# EAGLE design hatino (EAGLE 7.5.0)
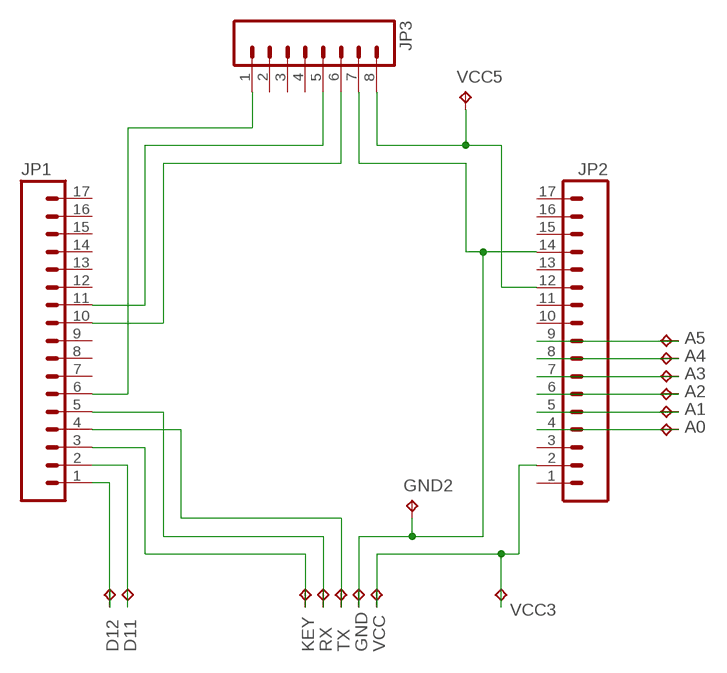
[diagram p0: schematic, sheet 1]

## Parts
A0  TPPAD1-13Y  [P1-13Y]
A1  TPPAD1-13Y  [P1-13Y]
A2  TPPAD1-13Y  [P1-13Y]
A3  TPPAD1-13Y  [P1-13Y]
A4  TPPAD1-13Y  [P1-13Y]
A5  TPPAD1-13Y  [P1-13Y]
D11  TPPAD1-13Y  [P1-13Y]
D12  TPPAD1-13Y  [P1-13Y]
GND  TPPAD1-13Y  [P1-13Y]
GND2  TPPAD1-13Y  [P1-13Y]
JP1  M17  [1X17]
JP2  M17  [1X17]
JP3  M08  [1X08_ROUND]
KEY  TPPAD1-13Y  [P1-13Y]
RX  TPPAD1-13Y  [P1-13Y]
TX  TPPAD1-13Y  [P1-13Y]
VCC  TPPAD1-13Y  [P1-13Y]
VCC3  TPPAD1-13Y  [P1-13Y]
VCC5  TPPAD1-13Y  [P1-13Y]

## Nets
N$1: D12.TP JP1.1
N$2: JP2.2 VCC3.TP VCC.TP
N$3: D11.TP JP1.2
N$4: A0.TP JP2.4
N$5: A1.TP JP2.5
N$6: A2.TP JP2.6
N$7: A3.TP JP2.7
N$8: A4.TP JP2.8
N$9: A5.TP JP2.9
N$12: JP2.12 JP3.8 VCC5.TP
N$14: GND2.TP GND.TP JP2.14 JP3.7
N$22: JP1.5 RX.TP
N$24: JP1.6 JP3.1
N$26: JP1.4 TX.TP
N$27: JP1.10 JP3.6
N$28: JP1.11 JP3.5
N$35: JP1.3 KEY.TP
Unconnected: JP1.7 JP1.8 JP1.9 JP1.12 JP1.13 JP1.14 JP1.15 JP1.16 JP1.17 JP2.1 JP2.3 JP2.10 JP2.11 JP2.13 JP2.15 JP2.16 JP2.17 JP3.2 JP3.3 JP3.4

## Library data of the parts
A0 A1-A5 D11 D12 GND GND2 KEY RX TX VCC VCC3 VCC5 = testpad:TP: Test pad
JP1 JP2 = SparkFun-Connectors:M17: 1x17 .1" header
JP3 = SparkFun-Connectors:M08: Header 8 Standard 8-pin 0.1" header. Use with straight break away headers (SKU : PRT-00116), right angle break away headers (PRT-00553), swiss pins (PRT-00743), machine pins (PRT-00117), and female headers (PRT-00115).

## Board
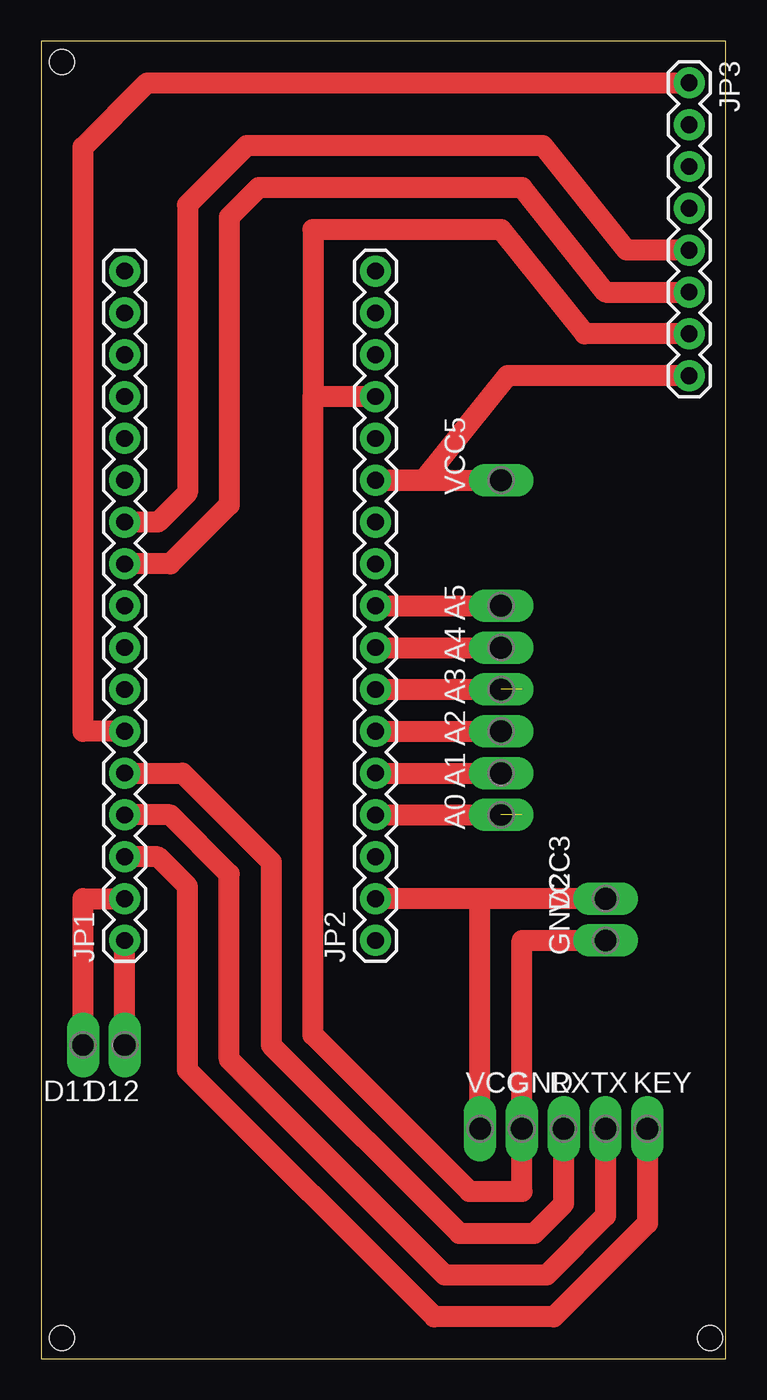
[diagram p1: board, top side]

Size 41.58 x 80 mm. Coordinates in mm from the lower left corner, seen from the top.
Outline: 0,0 41.58,0 41.58,80 0,80 0,0
Copper layers (1*16): Top 0.035mm / dielectric 1.5mm / Bottom 0.035mm
Design rules "default": minimum track width 10mil, minimum drill 24mil, track to track 8mil, track to pad 8mil, pad to pad 8mil, via to via 8mil, smd to smd 8mil, copper to edge 40mil, drill to drill 8mil, minimum pad ring 10mil, minimum via ring 8mil, stop-mask expansion 4mil, vias tented up to drill 0mil, thermal gap 10mil
Holes 1.5 mm at 1.27,78.74 40.64,1.27 1.27,1.27

### Footprints (pad centres in the part's own frame; a part is rotated, then mirrored left to right if it is on the bottom)
P1-13Y = drill 1.321 pad 1.905 long: TP 0,0
1X17 = drill 1.016 pad 1.88: 1 0,0; 2 2.54,0; 3 5.08,0; 4 7.62,0; 5 10.16,0; 6 12.7,0; 7 15.24,0; 8 17.78,0; 9 20.32,0; 10 22.86,0; 11 25.4,0; 12 27.94,0; 13 30.48,0; 14 33.02,0; 15 35.56,0; 16 38.1,0; 17 40.64,0
1X08_ROUND = drill 1.016 pad 1.88: 1 0,0; 2 2.54,0; 3 5.08,0; 4 7.62,0; 5 10.16,0; 6 12.7,0; 7 15.24,0; 8 17.78,0

### Placement (x,y rotation side)
A0  27.94,33.02 90 top
A1  27.94,35.56 90 top
A2  27.94,38.1 90 top
A3  27.94,40.64 90 top
A4  27.94,43.18 90 top
A5  27.94,45.72 90 top
D11  2.54,19.05 180 top
D12  5.08,19.05 180 top
GND  29.21,13.97 0 top
GND2  34.29,25.4 90 top
JP1  5.08,25.4 90 top
JP2  20.32,25.4 90 top
JP3  39.37,77.47 270 top
KEY  36.83,13.97 0 top
RX  31.75,13.97 0 top
TX  34.29,13.97 0 top
VCC  26.67,13.97 0 top
VCC3  34.29,27.94 90 top
VCC5  27.94,53.34 90 top

### Tracks (layer width: path | path; a pad name or v marks a point on that pad's centre or on a via)
N$1
  Top 1.27: D12.TP JP1.1
N$2
  Top 1.27: VCC.TP 26.67,27.94 | 26.67,27.94 JP2.2 | VCC3.TP 26.67,27.94
N$3
  Top 1.27: D11.TP 2.54,27.94 JP1.2
N$4  (1 unrouted)
  Top 1.27: JP2.4 29.21,33.02
N$5
  Top 1.27: JP2.5 A1.TP
N$6
  Top 1.27: JP2.6 A2.TP
N$7  (1 unrouted)
  Top 1.27: JP2.7 29.21,40.64
N$8
  Top 1.27: JP2.8 A4.TP
N$9
  Top 1.27: JP2.9 A5.TP
N$12
  Top 1.27: JP3.8 28.33,59.69 23.23,53.34 JP2.12 VCC5.TP
N$14
  Top 1.27: 16.51,58.42 16.51,19.67 26.02,10.16 29.21,10.16 GND.TP 29.21,25.4 GND2.TP | 16.51,58.42 16.51,68.58 27.94,68.58 33.02,62.23 JP3.7 | JP2.14 16.51,58.42
N$22
  Top 1.27: JP1.5 8.58,35.56 13.97,30.17 13.97,19.05 25.4,7.62 29.95,7.62 31.75,9.42 RX.TP
N$24
  Top 1.27: JP1.6 2.54,38.1 2.54,73.57 6.44,77.47 JP3.1
N$26
  Top 1.27: TX.TP 34.29,8.67 30.7,5.08 24.53,5.08 11.43,18.18 11.43,29.43 7.84,33.02 JP1.4
N$27
  Top 1.27: JP1.10 7.84,48.26 11.43,51.85 11.43,69.32 13.23,71.12 29.21,71.12 34.29,64.77 JP3.6
N$28
  Top 1.27: JP3.5 35.56,67.31 30.48,73.66 12.48,73.66 8.89,70.07 8.89,52.6 7.09,50.8 JP1.11
N$35
  Top 1.27: KEY.TP 36.83,8.22 31.15,2.54 23.88,2.54 8.89,17.53 8.89,28.68 7.09,30.48 JP1.3